# EAGLE design flags (EAGLE 9.2.2)
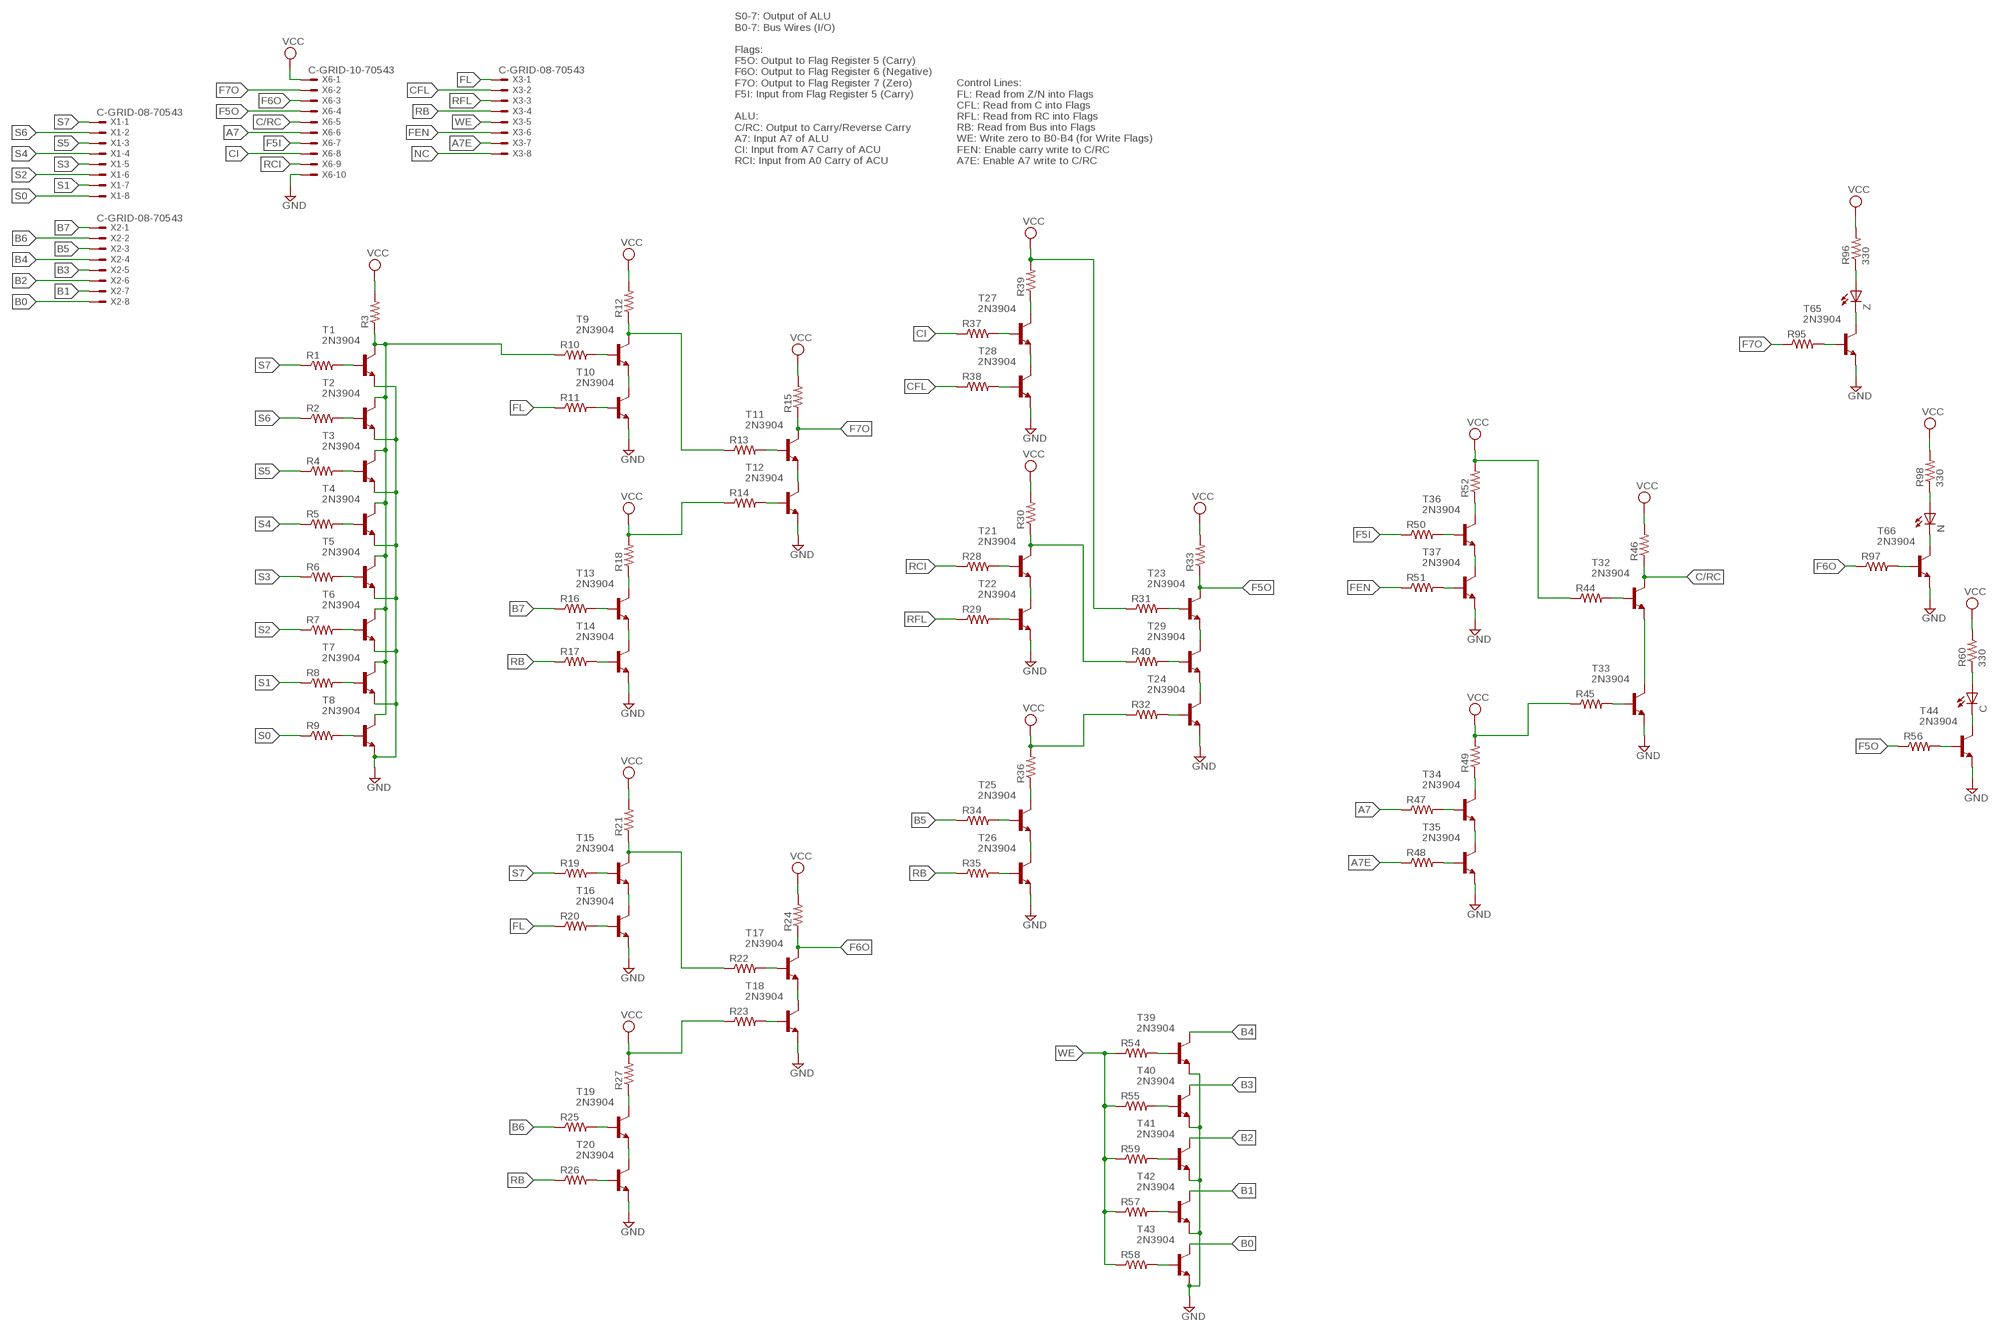
[diagram p0: schematic, sheet 1]

## Parts
C  LED5MM  [LED5MM]
N  LED5MM  [LED5MM]
R1  R-US_0309/10  [0309/10]
R2  R-US_0309/10  [0309/10]
R3  R-US_0309/10  [0309/10]
R4  R-US_0309/10  [0309/10]
R5  R-US_0309/10  [0309/10]
R6  R-US_0309/10  [0309/10]
R7  R-US_0309/10  [0309/10]
R8  R-US_0309/10  [0309/10]
R9  R-US_0309/10  [0309/10]
R10  R-US_0309/10  [0309/10]
R11  R-US_0309/10  [0309/10]
R12  R-US_0309/10  [0309/10]
R13  R-US_0309/10  [0309/10]
R14  R-US_0309/10  [0309/10]
R15  R-US_0309/10  [0309/10]
R16  R-US_0309/10  [0309/10]
R17  R-US_0309/10  [0309/10]
R18  R-US_0309/10  [0309/10]
R19  R-US_0309/10  [0309/10]
R20  R-US_0309/10  [0309/10]
R21  R-US_0309/10  [0309/10]
R22  R-US_0309/10  [0309/10]
R23  R-US_0309/10  [0309/10]
R24  R-US_0309/10  [0309/10]
R25  R-US_0309/10  [0309/10]
R26  R-US_0309/10  [0309/10]
R27  R-US_0309/10  [0309/10]
R28  R-US_0309/10  [0309/10]
R29  R-US_0309/10  [0309/10]
R30  R-US_0309/10  [0309/10]
R31  R-US_0309/10  [0309/10]
R32  R-US_0309/10  [0309/10]
R33  R-US_0309/10  [0309/10]
R34  R-US_0309/10  [0309/10]
R35  R-US_0309/10  [0309/10]
R36  R-US_0309/10  [0309/10]
R37  R-US_0309/10  [0309/10]
R38  R-US_0309/10  [0309/10]
R39  R-US_0309/10  [0309/10]
R40  R-US_0309/10  [0309/10]
R44  R-US_0309/10  [0309/10]
R45  R-US_0309/10  [0309/10]
R46  R-US_0309/10  [0309/10]
R47  R-US_0309/10  [0309/10]
R48  R-US_0309/10  [0309/10]
R49  R-US_0309/10  [0309/10]
R50  R-US_0309/10  [0309/10]
R51  R-US_0309/10  [0309/10]
R52  R-US_0309/10  [0309/10]
R54  R-US_0309/10  [0309/10]
R55  R-US_0309/10  [0309/10]
R56  R-US_0309/10  [0309/10]
R57  R-US_0309/10  [0309/10]
R58  R-US_0309/10  [0309/10]
R59  R-US_0309/10  [0309/10]
R60  330  R-US_0309/10  [0309/10]
R95  R-US_0309/10  [0309/10]
R96  330  R-US_0309/10  [0309/10]
R97  R-US_0309/10  [0309/10]
R98  330  R-US_0309/10  [0309/10]
T1  2N3904  [TO92]
T2  2N3904  [TO92]
T3  2N3904  [TO92]
T4  2N3904  [TO92]
T5  2N3904  [TO92]
T6  2N3904  [TO92]
T7  2N3904  [TO92]
T8  2N3904  [TO92]
T9  2N3904  [TO92]
T10  2N3904  [TO92]
T11  2N3904  [TO92]
T12  2N3904  [TO92]
T13  2N3904  [TO92]
T14  2N3904  [TO92]
T15  2N3904  [TO92]
T16  2N3904  [TO92]
T17  2N3904  [TO92]
T18  2N3904  [TO92]
T19  2N3904  [TO92]
T20  2N3904  [TO92]
T21  2N3904  [TO92]
T22  2N3904  [TO92]
T23  2N3904  [TO92]
T24  2N3904  [TO92]
T25  2N3904  [TO92]
T26  2N3904  [TO92]
T27  2N3904  [TO92]
T28  2N3904  [TO92]
T29  2N3904  [TO92]
T32  2N3904  [TO92]
T33  2N3904  [TO92]
T34  2N3904  [TO92]
T35  2N3904  [TO92]
T36  2N3904  [TO92]
T37  2N3904  [TO92]
T39  2N3904  [TO92]
T40  2N3904  [TO92]
T41  2N3904  [TO92]
T42  2N3904  [TO92]
T43  2N3904  [TO92]
T44  2N3904  [TO92]
T65  2N3904  [TO92]
T66  2N3904  [TO92]
X1  C-GRID-08-70543  [70543-08]
X2  C-GRID-08-70543  [70543-08]
X3  C-GRID-08-70543  [70543-08]
X6  C-GRID-10-70543  [70543-10]
Z  LED5MM  [LED5MM]

## Nets
A7: R47.1 X6.6
A7E: R48.1 X3.7
B0: T43.1(C) X2.8
B1: T42.1(C) X2.7
B2: T41.1(C) X2.6
B3: T40.1(C) X2.5
B4: T39.1(C) X2.4
B5: R34.1 X2.3
B6: R25.1 X2.2
B7: R16.1 X2.1
C/RC: R46.1 T32.1(C) X6.5
CFL: R38.1 X3.2
CI: R37.1 X6.8
F5I: R50.1 X6.7
F5O: R33.1 R56.1 T23.1(C) X6.4
F6O: R24.1 R97.1 T17.1(C) X6.3
F7O: R15.1 R95.1 T11.1(C) X6.2
FEN: R51.1 X3.6
FL: R11.1 R20.1 X3.1
GND: T1.3(E) T2.3(E) T3.3(E) T4.3(E) T5.3(E) T6.3(E) T7.3(E) T8.3(E) T10.3(E) T12.3(E) T14.3(E) T16.3(E) T18.3(E) T20.3(E) T22.3(E) T24.3(E) T26.3(E) T28.3(E) T33.3(E) T35.3(E) T37.3(E) T39.3(E) T40.3(E) T41.3(E) T42.3(E) T43.3(E) T44.3(E) T65.3(E) T66.3(E) X6.10
N$1: R3.1 R10.1 T1.1(C) T2.1(C) T3.1(C) T4.1(C) T5.1(C) T6.1(C) T7.1(C) T8.1(C)
N$2: R1.2 T1.2(B)
N$3: R2.2 T2.2(B)
N$4: R4.2 T3.2(B)
N$5: R5.2 T4.2(B)
N$6: R6.2 T5.2(B)
N$7: R7.2 T6.2(B)
N$8: R8.2 T7.2(B)
N$9: R9.2 T8.2(B)
N$10: R30.1 R40.1 T21.1(C)
N$11: R12.1 R13.1 T9.1(C)
N$12: T9.3(E) T10.1(C)
N$13: R11.2 T10.2(B)
N$14: R10.2 T9.2(B)
N$15: R21.1 R22.1 T15.1(C)
N$16: T15.3(E) T16.1(C)
N$17: R20.2 T16.2(B)
N$18: R19.2 T15.2(B)
N$19: R18.1 T13.1(C)
N$20: R16.2 T13.2(B)
N$21: R17.2 T14.2(B)
N$22: T13.3(E) T14.1(C)
N$23: R27.1 T19.1(C)
N$24: R14.2 T12.2(B)
N$25: T11.3(E) T12.1(C)
N$26: R13.2 T11.2(B)
N$27: R25.2 T19.2(B)
N$28: R26.2 T20.2(B)
N$29: T19.3(E) T20.1(C)
N$30: R23.2 T18.2(B)
N$31: T17.3(E) T18.1(C)
N$32: R22.2 T17.2(B)
N$33: T21.3(E) T22.1(C)
N$34: R29.2 T22.2(B)
N$35: R28.2 T21.2(B)
N$36: R36.1 T25.1(C)
N$37: R34.2 T25.2(B)
N$38: R35.2 T26.2(B)
N$39: T25.3(E) T26.1(C)
N$40: R32.2 T24.2(B)
N$41: T23.3(E) T29.1(C)
N$42: R31.2 T23.2(B)
N$43: R39.1 T27.1(C)
N$44: R37.2 T27.2(B)
N$45: R38.2 T28.2(B)
N$46: T27.3(E) T28.1(C)
N$47: T24.1(C) T29.3(E)
N$48: R40.2 T29.2(B)
N$53: R49.1 T34.1(C)
N$54: R47.2 T34.2(B)
N$55: R48.2 T35.2(B)
N$56: T34.3(E) T35.1(C)
N$57: R45.2 T33.2(B)
N$58: R44.2 T32.2(B)
N$59: R52.1 T36.1(C)
N$60: R50.2 T36.2(B)
N$61: R51.2 T37.2(B)
N$62: T36.3(E) T37.1(C)
N$63: T32.3(E) T33.1(C)
N$66: R56.2 T44.2(B)
N$67: R54.2 T39.2(B)
N$68: R55.2 T40.2(B)
N$69: R59.2 T41.2(B)
N$70: R57.2 T42.2(B)
N$71: R58.2 T43.2(B)
N$72: C.A R60.1
N$73: C.K(C) T44.1(C)
N$121: R96.1 Z.A
N$122: R95.2 T65.2(B)
N$123: R97.2 T66.2(B)
N$124: T65.1(C) Z.K(C)
N$125: N.A R98.1
N$126: N.K(C) T66.1(C)
NC: X3.8
RB: R17.1 R26.1 R35.1 X3.4
RCI: R28.1 X6.9
RFL: R29.1 X3.3
S0: R9.1 X1.8
S1: R8.1 X1.7
S2: R7.1 X1.6
S3: R6.1 X1.5
S4: R5.1 X1.4
S5: R4.1 X1.3
S6: R2.1 X1.2
S7: R1.1 R19.1 X1.1
VCC: R3.2 R12.2 R14.1 R15.2 R18.2 R21.2 R23.1 R24.2 R27.2 R30.2 R31.1 R32.1 R33.2 R36.2 R39.2 R44.1 R45.1 R46.2 R49.2 R52.2 R60.2 R96.2 R98.2 X6.1
WE: R54.1 R55.1 R57.1 R58.1 R59.1 X3.5

## Notes on the sheet
- S0-7: Output of ALU
  B0-7: Bus Wires (I/O)
  
  Flags:
  F5O: Output to Flag Register 5 (Carry)
  F6O: Output to Flag Register 6 (Negative)
  F7O: Output to Flag Register 7 (Zero)
  F5I: Input from Flag Register 5 (Carry)
  
  ALU:
  C/RC: Output to Carry/Reverse Carry
  A7: Input A7 of ALU
  CI: Input from A7 Carry of ACU
  RCI: Input from A0 Carry of ACU
- Control Lines:
  FL: Read from Z/N into Flags
  CFL: Read from C into Flags
  RFL: Read from RC into Flags
  RB: Read from Bus into Flags
  WE: Write zero to B0-B4 (for Write Flags)
  FEN: Enable carry write to C/RC
  A7E: Enable A7 write to C/RC

## Library data of the parts
C N Z = led:LED: LED OSRAM: - CHIPLED LG R971, LG N971, LY N971, LG Q971, LY Q971, LO R971, LY R971 LH N974, LH R974 LS Q976, LO Q976, LY Q976 LO Q996 - Hyper CHIPLED LW Q18S LB Q993, LB Q99A, LB R99A - SideLED LS A670, LO A670, LY A670, LG A670, LP A670 LB A673, LV A673, LT A673, LW A673 LH A674 LY A675 LS A676, LA A676, LO A676, LY A676, LW A676 LS A679, LY A679, LG A679 - Hyper Micro SIDELED® LS Y876, LA Y876, LO Y876, LY Y876 LT Y87S - SmartLED LW L88C, LW L88S LB L89C, LB L89S, LG L890 LS L89K, LO L89K, LY L89K LS L896, LA L896, LO L896, LY L896 - TOPLED LS T670, LO T670, LY T670, LG T670, LP T670 LSG T670, LSP T670, LSY T670, LOP T670, LYG T670 LG T671, LOG T671, LSG T671 LB T673, LV T673, LT T673, LW T673 LH T674 LS T676, LA T676, LO T676, LY T676, LB T676, LH T676, LSB T676, LW T676 LB T67C, LV T67C, LT T67C, LS T67K, LO T67K, LY T67K, LW E67C LS E67B, LA E67B, LO E67B, LY E67B, LB E67C, LV E67C, LT E67C LW T67C LS T679, LY T679, LG T679 LS T770, LO T770, LY T770, LG T770, LP T770 LB T773, LV T773, LT T773, LW T773 LH T774 LS E675, LA E675, LY E675, LS T675 LS T776, LA T776, LO T776, LY T776, LB T776 LHGB T686 LT T68C, LB T68C - Hyper Mini TOPLED® LB M676 - Mini TOPLED Santana® LG M470 LS M47K, LO M47K, LY M47K Source: http://www.osram.convergy.de LUXEON: - LUMILED® LXK2-PW12-R00, LXK2-PW12-S00, LXK2-PW14-U00, LXK2-PW14-V00 LXK2-PM12-R00, LXK2-PM12-S00, LXK2-PM14-U00 LXK2-PE12-Q00, LXK2-PE12-R00, LXK2-PE12-S00, LXK2-PE14-T00, LXK2-PE14-U00 LXK2-PB12-K00, LXK2-PB12-L00, LXK2-PB12-M00, LXK2-PB14-N00, LXK2-PB14-P00, LXK2-PB14-Q00 LXK2-PR12-L00, LXK2-PR12-M00, LXK2-PR14-Q00, LXK2-PR14-R00 LXK2-PD12-Q00, LXK2-PD12-R00, LXK2-PD12-S00 LXK2-PH12-R00, LXK2-PH12-S00 LXK2-PL12-P00, LXK2-PL12-Q00, LXK2-PL12-R00 Source: www.luxeon.com KINGBRIGHT: KA-3528ASYC Source: www.kingbright.com
R1-R40 R44-R52 R54-R60 R95-R98 = resistor:R-US_: RESISTOR, American symbol
T1-T29 T32-T37 T39-T44 T65 T66 = transistor:2N3904: NPN TRANSISTOR
X1-X3 = con-molex:C-GRID-08: CONNECTOR wire to board 2.54 mm (0.100") pitch header; MF: MOLEX; OC_FARNELL: unknown; OC_NEWARK: unknown
X6 = con-molex:C-GRID-10: CONNECTOR wire to board 2.54 mm (0.100") pitch header; MF: MOLEX; OC_FARNELL: unknown; OC_NEWARK: unknown

## Board
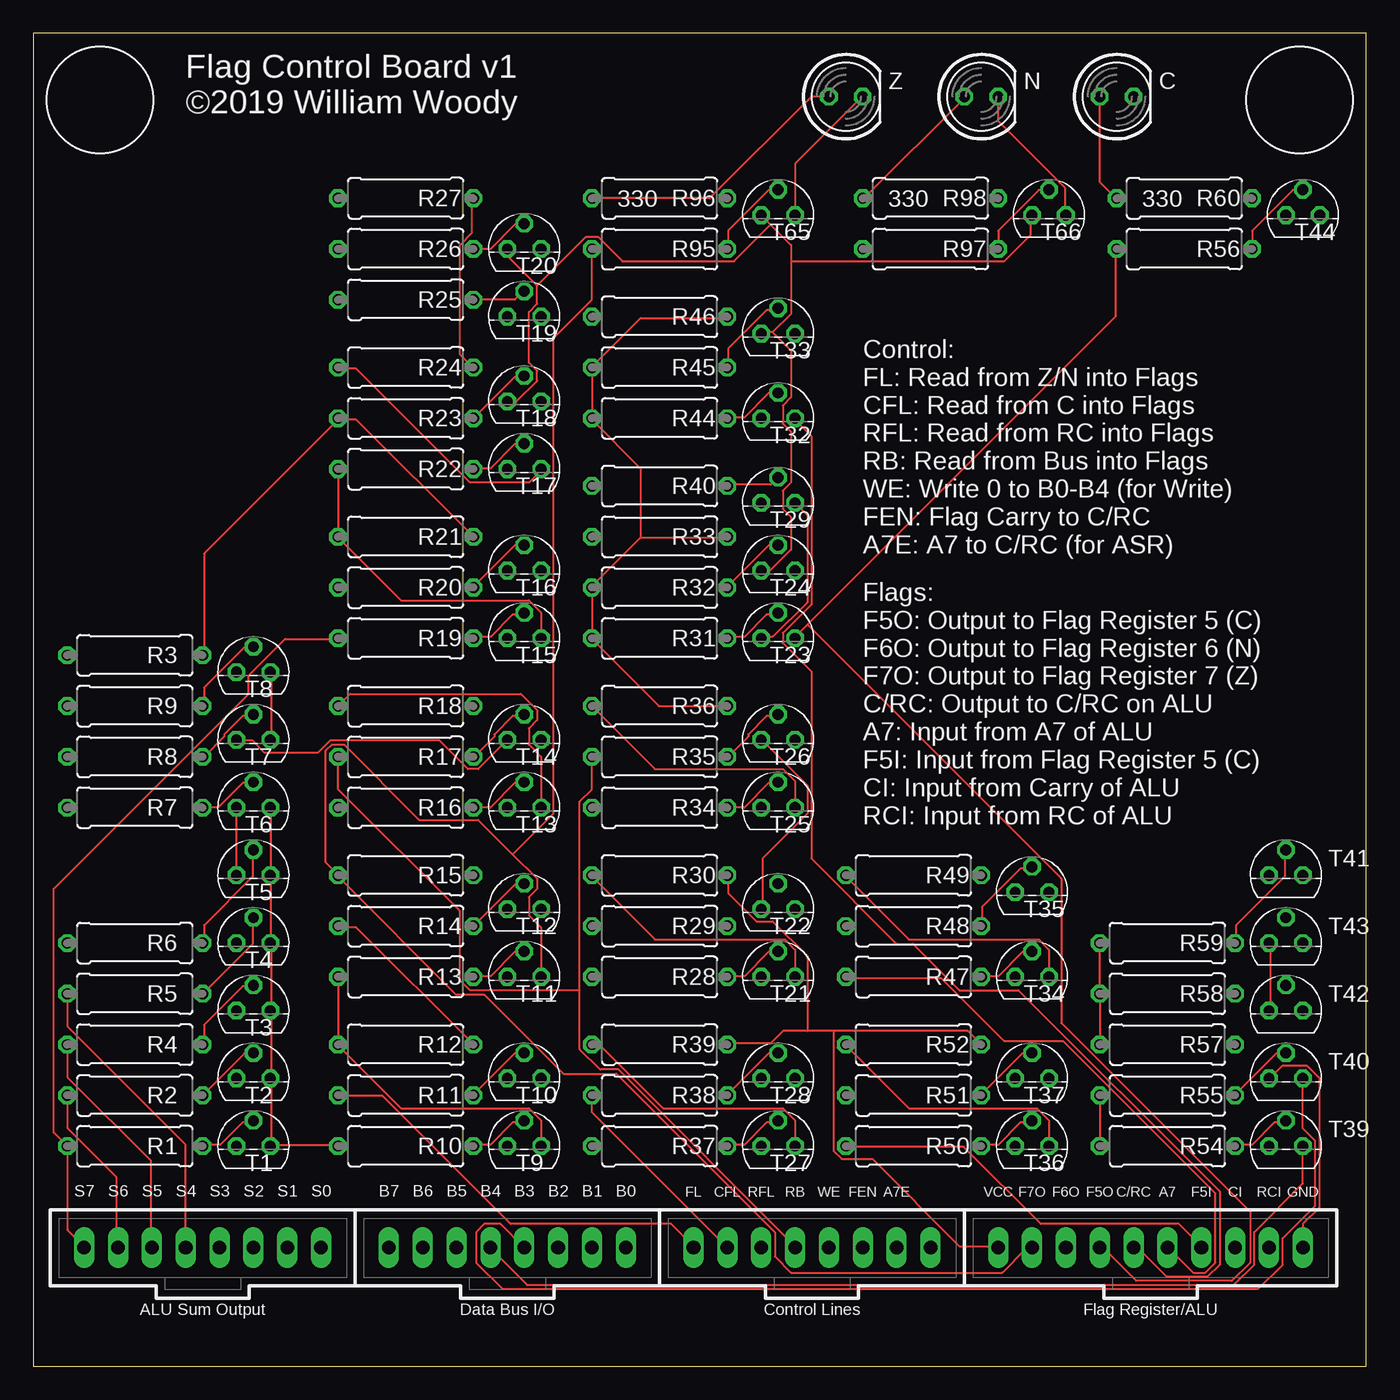
[diagram p1: board, top side]
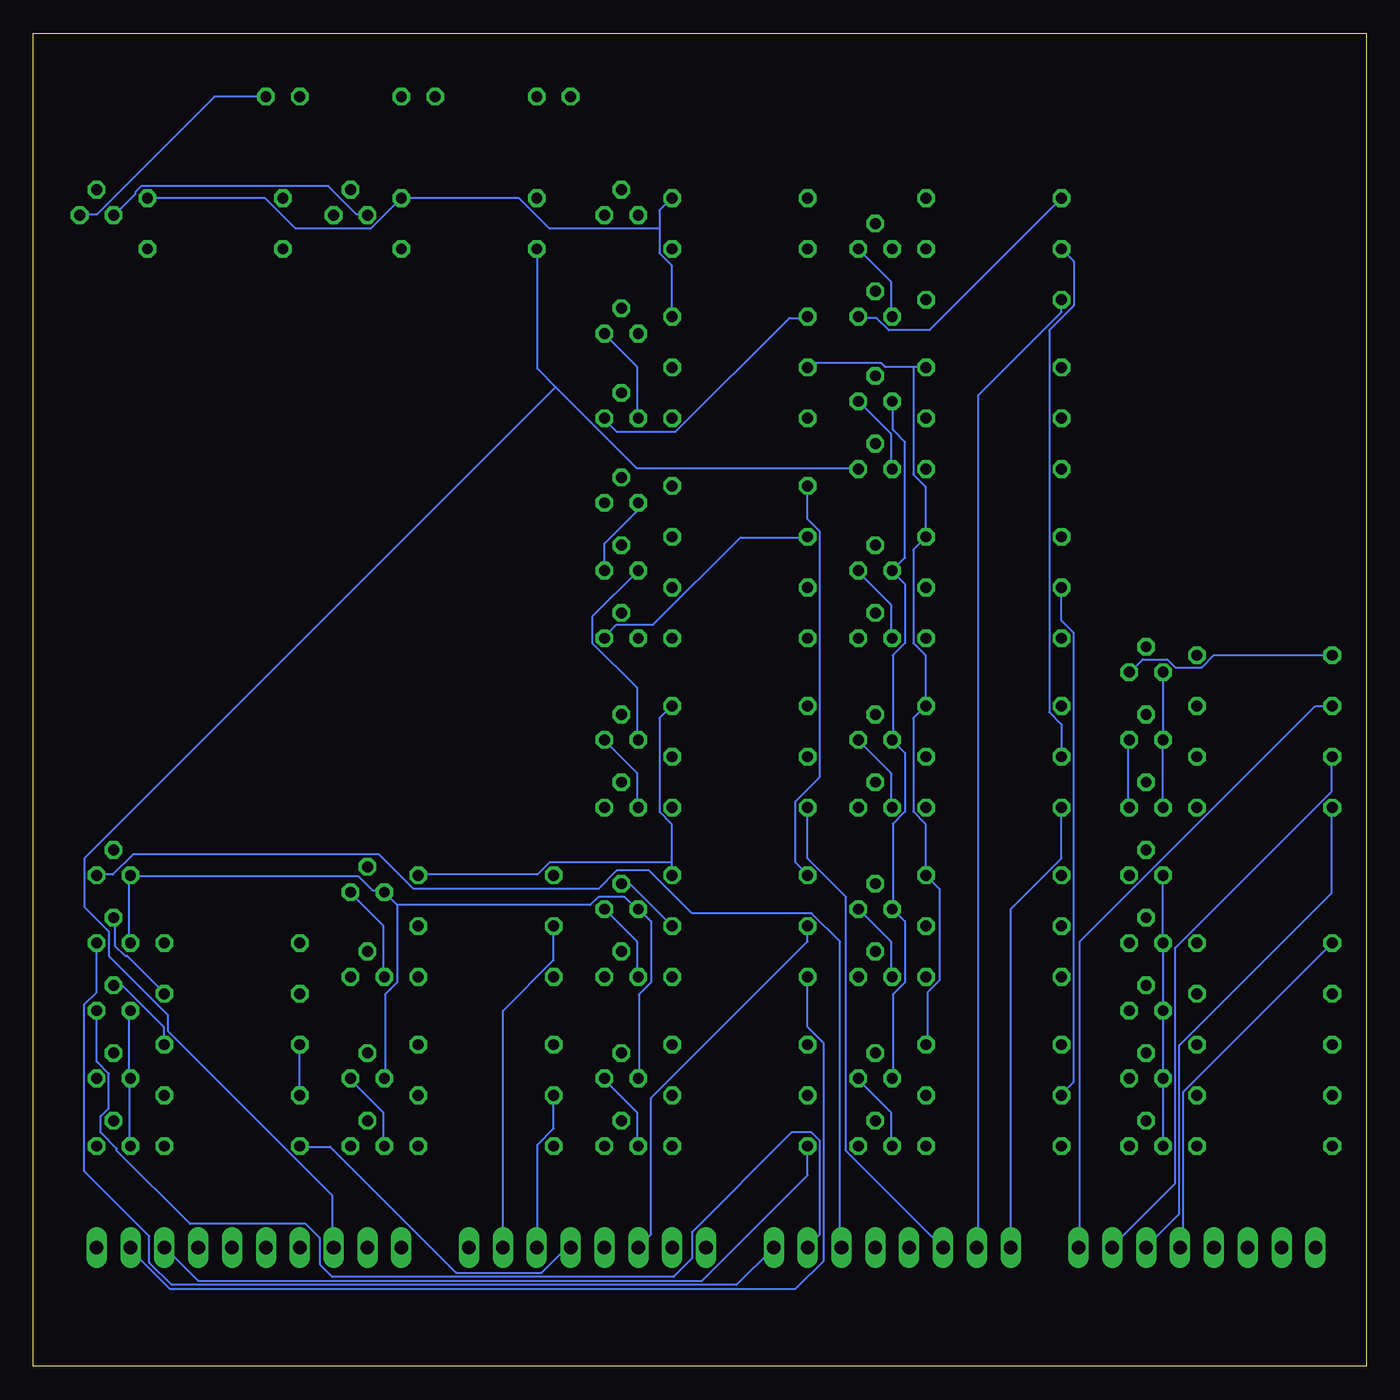
[diagram p2: board, bottom side, seen from below]

Size 100 x 100 mm. Coordinates in mm from the lower left corner, seen from the top.
Outline: 0,0 100,0 100,100 0,100 0,0
Copper layers (1*16): Top 0.035mm / dielectric 1.5mm / Bottom 0.035mm
Design rules "default": minimum track width 6mil, minimum drill 0.35mm, track to track 6mil, track to pad 6mil, pad to pad 6mil, via to via 6mil, smd to smd 6mil, copper to edge 40mil, drill to drill 6mil, minimum pad ring 10mil, minimum via ring 8mil, stop-mask expansion 4mil, vias tented up to drill 0mil, thermal gap 10mil

### Footprints (pad centres in the part's own frame; a part is rotated, then mirrored left to right if it is on the bottom)
LED5MM = drill 0.813 octagon: A -1.27,0; K 1.27,0
0309/10 = drill 0.813 octagon: 1 -5.08,0; 2 5.08,0
TO92 = drill 0.813 octagon: 1 1.27,0; 2 0,1.905; 3 -1.27,0
70543-08 = drill 1.016 long: 1 -8.89,0; 2 -6.35,0; 3 -3.81,0; 4 -1.27,0; 5 1.27,0; 6 3.81,0; 7 6.35,0; 8 8.89,0
70543-10 = drill 1.016 long: 1 -11.43,0; 2 -8.89,0; 3 -6.35,0; 4 -3.81,0; 5 -1.27,0; 6 1.27,0; 7 3.81,0; 8 6.35,0; 9 8.89,0; 10 11.43,0

### Placement (x,y rotation side)
C  81.28,95.25 0 top
N  71.12,95.25 0 top
R1  7.62,16.51 0 top
R2  7.62,20.32 0 top
R3  7.62,53.34 0 top
R4  7.62,24.13 0 top
R5  7.62,27.94 0 top
R6  7.62,31.75 0 top
R7  7.62,41.91 0 top
R8  7.62,45.72 0 top
R9  7.62,49.53 0 top
R10  27.94,16.51 0 top
R11  27.94,20.32 0 top
R12  27.94,24.13 0 top
R13  27.94,29.21 0 top
R14  27.94,33.02 0 top
R15  27.94,36.83 0 top
R16  27.94,41.91 0 top
R17  27.94,45.72 0 top
R18  27.94,49.53 0 top
R19  27.94,54.61 0 top
R20  27.94,58.42 0 top
R21  27.94,62.23 0 top
R22  27.94,67.31 0 top
R23  27.94,71.12 0 top
R24  27.94,74.93 0 top
R25  27.94,80.01 0 top
R26  27.94,83.82 0 top
R27  27.94,87.63 0 top
R28  46.99,29.21 0 top
R29  46.99,33.02 0 top
R30  46.99,36.83 0 top
R31  46.99,54.61 0 top
R32  46.99,58.42 0 top
R33  46.99,62.23 0 top
R34  46.99,41.91 0 top
R35  46.99,45.72 0 top
R36  46.99,49.53 0 top
R37  46.99,16.51 0 top
R38  46.99,20.32 0 top
R39  46.99,24.13 0 top
R40  46.99,66.04 0 top
R44  46.99,71.12 0 top
R45  46.99,74.93 0 top
R46  46.99,78.74 0 top
R47  66.04,29.21 0 top
R48  66.04,33.02 0 top
R49  66.04,36.83 0 top
R50  66.04,16.51 0 top
R51  66.04,20.32 0 top
R52  66.04,24.13 0 top
R54  85.09,16.51 0 top
R55  85.09,20.32 0 top
R56  86.36,83.82 0 top
R57  85.09,24.13 0 top
R58  85.09,27.94 0 top
R59  85.09,31.75 0 top
R60  86.36,87.63 0 top
R95  46.99,83.82 0 top
R96  46.99,87.63 0 top
R97  67.31,83.82 0 top
R98  67.31,87.63 0 top
T1  16.51,16.51 0 top
T2  16.51,21.59 0 top
T3  16.51,26.67 0 top
T4  16.51,31.75 0 top
T5  16.51,36.83 0 top
T6  16.51,41.91 0 top
T7  16.51,46.99 0 top
T8  16.51,52.07 0 top
T9  36.83,16.51 0 top
T10  36.83,21.59 0 top
T11  36.83,29.21 0 top
T12  36.83,34.29 0 top
T13  36.83,41.91 0 top
T14  36.83,46.99 0 top
T15  36.83,54.61 0 top
T16  36.83,59.69 0 top
T17  36.83,67.31 0 top
T18  36.83,72.39 0 top
T19  36.83,78.74 0 top
T20  36.83,83.82 0 top
T21  55.88,29.21 0 top
T22  55.88,34.29 0 top
T23  55.88,54.61 0 top
T24  55.88,59.69 0 top
T25  55.88,41.91 0 top
T26  55.88,46.99 0 top
T27  55.88,16.51 0 top
T28  55.88,21.59 0 top
T29  55.88,64.77 0 top
T32  55.88,71.12 0 top
T33  55.88,77.47 0 top
T34  74.93,29.21 0 top
T35  74.93,35.56 0 top
T36  74.93,16.51 0 top
T37  74.93,21.59 0 top
T39  93.98,16.51 0 top
T40  93.98,21.59 0 top
T41  93.98,36.83 0 top
T42  93.98,26.67 0 top
T43  93.98,31.75 0 top
T44  95.25,86.36 0 top
T65  55.88,86.36 0 top
T66  76.2,86.36 0 top
X1  12.7,8.89 0 top
X2  35.56,8.89 0 top
X3  58.42,8.89 0 top
X6  83.82,8.89 0 top
Z  60.96,95.25 0 top

### Tracks (layer width: path | path; a pad name or v marks a point on that pad's centre or on a via)
A7
  Top 0.152: R47.1 60.96,29.11 68.12,29.11 72.85,24.38 77.27,24.38 88.7,12.95 88.7,7.77 87.94,7.01 87.02,7.01 85.19,8.84 X6.6
A7E
  Bottom 0.152: R48.1 60.96,30.48 64.77,26.67 X3.7
B0
  Bottom 0.152: T43.1 95.25,28.04 96.16,27.13 96.16,14.63 91.29,9.75 91.29,7.77 89.61,6.1 47.24,6.1 X2.8
B1
  Bottom 0.152: T42.1 95.25,22.86 94.34,21.95 94.34,19.36 94.94,18.75 94.94,17.53 93.73,16.31 93.73,16.15 88.24,10.67 79.55,10.67 78.49,9.6 78.49,7.62 77.57,6.71 51.97,6.71 50.6,8.08 50.6,10.06 43.13,17.53 41.6,17.53 41,16.92 41,9.91 41.91,8.99 X2.7
B2
  Bottom 0.152: T41.1 95.25,36.88 94.03,36.88 92.51,38.41 74.07,38.41 71.48,35.81 57.61,35.81 56.24,37.19 53.8,37.19 50.6,33.98 41.6,33.98 39.47,31.85 39.47,8.99 X2.6
B3
  Top 0.152: T40.1 95.25,17.83 96.16,16.92 96.16,12.04 93.73,9.6 93.73,7.62 91.9,5.79 35.2,5.79 33.22,7.77 33.22,10.06 33.83,10.67 35.05,10.67 X2.5
B4
  Top 0.152: T39.1 95.25,13.72 91.59,10.06 91.59,7.62 90.07,6.1 37.03,6.1 34.29,8.84 X2.4
B5
  Bottom 0.152: R34.1 41.91,38.1 39.01,35.2 39.01,16.15 X2.3
B6
  Bottom 0.152: R25.1 22.86,79.1 29.11,72.85 29.11,8.99 X2.2
B7
  Bottom 0.152: R16.1 22.86,38.1 26.67,34.29 X2.1
C/RC
  Top 0.152: X6.5 82.6,8.84 82.91,8.84 85.04,6.71 88.09,6.71 89,7.62 89,13.11 73.91,28.19 69.49,28.19 65.99,31.7 64.77,31.7 58.37,38.1 58.37,52.12 56.24,54.25 56.24,55.02 58.37,57.15 58.37,69.8 57.15,71.02 T32.1
  Bottom 0.152: R46.1 41.91,78.64 43.28,78.64 51.82,70.1 56.24,70.1 57.15,71.02 T32.1
CFL
  Top 0.152: R38.1 41.91,19.05 X3.2
CI
  Bottom 0.152: R37.1 41.91,14.33 49.84,6.4 87.63,6.4 90.07,8.84 X6.8
F5I
  Top 0.152: R50.1 60.96,16.46 69.8,16.46 75.59,10.67 85.95,10.67 87.63,8.99 X6.7
F5O
  Top 0.152: 58.06,55.63 57.15,54.71 T23.1 | 58.06,55.63 81.23,78.79 81.23,83.82 R56.1 | 58.06,55.63 77.11,36.58 77.11,25.76 91.29,11.58 91.29,7.77 89.92,6.4 82.75,6.4 80.31,8.84 80.01,8.84 X6.4
  Bottom 0.152: R33.1 41.91,62.18 46.94,62.18 53.49,55.63 56.24,55.63 57.15,54.71 T23.1
F6O
  Top 0.152: R24.1 22.86,74.83 24.23,74.83 32.77,66.29 37.19,66.29 38.1,67.21 T17.1
  Bottom 0.152: 60.81,73.46 54.71,67.36 38.1,67.36 T17.1 | 60.81,73.46 62.18,74.83 62.18,83.82 R97.1 | 60.81,73.46 96.16,38.1 96.16,34.44 94.34,32.61 94.34,30.79 89.92,26.36 89.92,25.15 77.57,12.8 77.57,8.99 X6.3
F7O
  Top 0.152: T11.1 38.1,32.92 37.19,33.83 37.19,35.2 37.8,35.81 37.8,36.58 35.97,38.41 | 35.97,38.41 33.38,41 28.96,41 23.32,46.63 22.4,46.63 21.95,46.18 21.95,37.8 22.86,36.88 R15.1 22.86,36.73 31.7,27.89 33.83,27.89 39.78,21.95 43.74,21.95 55.63,10.06 55.63,8.23 56.84,7.01 72.69,7.01 74.52,8.84 74.83,8.84 X6.2 | R95.1 41.91,80.01 39.01,77.11 39.01,41.45 35.97,38.41
FEN
  Bottom 0.152: R51.1 60.96,17.83 62.18,16.61 62.18,8.99 X3.6
FL
  Top 0.152: R11.1 22.86,20.27 26.21,20.27 35.81,10.67 47.85,10.67 49.53,8.99 X3.1
  Bottom 0.152: R20.1 22.86,55.93 21.95,55.02 21.95,21.34 22.86,20.42 R11.1
GND
  Top 0.152: T42.3 92.81,26.67 92.81,31.7 T43.3 | X6.10 95.25,10.67 96.47,11.89 96.47,21.64 95.56,22.55 93.73,22.55 92.81,21.64 T40.3 | T22.3 54.71,34.29 54.71,38.1 58.06,41.45 58.06,43.59 54.71,46.94 T26.3 | 55.47,77.57 54.71,77.57 T33.3 | 55.47,77.57 56.84,78.94 56.84,82.91 | 56.84,82.91 56.84,84.12 55.32,85.65 | T65.3 55.32,85.65 | 56.84,82.91 72.85,82.91 74.83,84.89 74.83,86.26 T66.3 | T5.3 T6.3 | 37.8,81.08 35.66,83.21 35.66,83.82 T20.3 | 37.8,81.08 37.8,79.7 37.19,79.1 37.19,75.29 37.8,74.68 37.8,73.91 36.27,72.39 T18.3 | T14.3 33.38,44.81 32.61,44.81 30.48,46.94 22.25,46.94 21.34,46.02 17.37,46.02 16.46,46.94 15.24,46.94 T7.3 | 55.32,85.65 52.58,82.91 44.2,82.91 42.37,84.73 41.45,84.73 37.8,81.08 | 55.47,77.57 56.84,76.2 56.84,72.69 56.24,72.08 56.24,70.71 56.84,70.1 56.84,66.29 56.24,65.68 56.24,64.31 56.84,63.7 56.84,61.27 55.32,59.74 54.71,59.74 T24.3
  Bottom 0.152: T43.3 92.81,31.85 92.81,36.73 T41.3 92.66,36.73 75.59,36.73 74.52,35.66 73.76,35.66 T35.3 72.69,34.59 | T39.3 92.81,16.61 92.81,21.49 T40.3 92.81,21.64 92.81,26.67 T42.3 | 72.69,34.59 72.69,28.8 73.61,27.89 73.61,21.64 T37.3 | T28.3 54.56,21.64 54.56,27.89 53.65,28.8 53.65,33.38 54.56,34.29 T22.3 54.71,34.29 55.63,35.2 57.61,35.2 58.22,34.59 72.69,34.59 | T24.3 58.06,56.24 58.06,54.25 54.71,50.9 54.71,47.09 T26.3 | T44.3 93.88,86.41 92.35,87.94 92.35,88.09 91.9,88.54 77.88,88.54 75.74,86.41 74.98,86.41 T66.3 | T8.3 T7.3 T6.3 | T1.3 T2.3 T3.3 T4.3 T5.3 | 35.51,34.29 34.59,33.38 34.59,28.8 35.51,27.89 35.51,21.64 T10.3 | T18.3 35.51,72.39 35.51,70.26 34.59,69.34 34.59,60.66 T16.3 35.51,59.59 34.59,58.67 34.59,54.25 35.51,53.34 35.51,47.09 T14.3 34.59,46.02 34.59,41.6 35.51,40.69 35.51,34.29 | 35.51,34.29 T12.3
N$1
  Top 0.152: T7.1 17.83,47.09 17.83,51.97 T8.1 | 17.83,16.61 17.83,21.49 T2.1 17.83,21.64 17.83,26.67 | 17.83,16.61 22.86,16.61 R10.1 | 17.83,16.61 T1.1 | 17.83,26.67 17.83,31.7 T4.1 17.83,31.85 17.83,36.73 T5.1 17.83,36.88 17.83,41.91 T6.1 | 17.83,26.67 T3.1
  Bottom 0.152: R3.1 11.43,53.34 12.34,52.43 14.33,52.43 14.94,53.03 16.76,53.03 17.68,52.12 T8.1 | T7.1 17.83,46.94 17.83,41.91 T6.1
N$2
  Top 0.152: R1.2 12.8,16.61 14.02,16.61 15.7,18.29 16.46,18.29 T1.2
N$3
  Top 0.152: R2.2 15.85,23.47 16.46,23.47 T2.2
N$4
  Top 0.152: R4.2 12.8,24.23 12.8,25.6 15.7,28.5 16.46,28.5 T3.2
N$5
  Top 0.152: R5.2 16.46,31.7 16.46,33.53 T4.2
N$6
  Top 0.152: R6.2 12.8,31.85 12.8,33.07 16.46,36.73 16.46,38.71 T5.2
N$7
  Top 0.152: R7.2 13.87,41.91 15.7,43.74 16.46,43.74 T6.2
N$8
  Top 0.152: R8.2 12.8,45.72 14.33,47.24 14.33,47.4 15.7,48.77 16.46,48.77 T7.2
N$9
  Top 0.152: R9.2 12.8,49.53 12.8,50.9 15.85,53.95 16.46,53.95 T8.2
N$10
  Top 0.152: T21.1 57.15,31.24 56.39,32 46.63,32 41.91,36.73 R30.1
  Bottom 0.152: R40.1 41.91,63.55 41,62.64 41,44.2 42.82,42.37 42.82,37.8 41.91,36.88 R30.1
N$11
  Top 0.152: R13.1 R12.1 22.86,24.08 27.58,19.36 37.19,19.36 38.1,18.44 T9.1
N$12
  Bottom 0.152: T9.3 35.66,16.61 35.66,19.05 38.1,21.49 T10.1
N$13
  Top 0.152: R11.2 33.07,20.42 36.12,23.47 36.73,23.47 T10.2
N$14
  Top 0.152: R10.2 33.07,16.61 34.29,16.61 35.97,18.29 36.73,18.29 T9.2
N$15
  Top 0.152: R22.1 R21.1 22.86,62.18 27.58,57.45 37.19,57.45 38.1,56.54 T15.1
N$16
  Bottom 0.152: T15.3 35.66,54.71 35.66,57.15 38.1,59.59 T16.1
N$17
  Top 0.152: R20.2 33.07,58.52 36.12,61.57 36.73,61.57 T16.2
N$18
  Top 0.152: R19.2 33.07,54.71 34.29,54.71 35.97,56.39 36.73,56.39 T15.2
N$19
  Top 0.152: T13.1 38.1,45.72 37.19,46.63 37.19,47.85 37.8,48.46 37.8,49.23 36.58,50.44 23.77,50.44 R18.1
N$20
  Top 0.152: R16.2 34.29,41.91 36.12,43.74 36.73,43.74 T13.2
N$21
  Top 0.152: R17.2 33.07,45.72 34.59,47.24 34.59,47.4 35.97,48.77 36.73,48.77 T14.2
N$22
  Bottom 0.152: T13.3 35.66,41.91 35.66,44.5 38.1,46.94 T14.1
N$23
  Bottom 0.152: R27.1 32.77,77.72 35.81,77.72 36.73,78.64 38.1,78.64 T19.1
N$24
  Top 0.152: R14.2 36.12,36.12 36.73,36.12 T12.2
N$25
  Bottom 0.152: T12.1 35.66,31.85 35.66,29.26 T11.3
N$26
  Top 0.152: R13.2 33.07,29.26 34.29,29.26 36.12,31.09 36.73,31.09 T11.2
N$27
  Top 0.152: R25.2 36.12,80.01 36.73,80.62 T19.2
N$28
  Top 0.152: R26.2 34.29,83.82 36.12,85.65 36.73,85.65 T20.2
N$29
  Bottom 0.152: T20.1 35.66,81.38 35.66,78.79 T19.3
N$30
  Top 0.152: R23.2 36.12,74.22 36.73,74.22 T18.2
N$31
  Bottom 0.152: T18.1 35.66,69.95 35.66,67.36 T17.3
N$32
  Top 0.152: R22.2 33.07,67.36 34.29,67.36 36.12,69.19 36.73,69.19 T17.2
N$33
  Bottom 0.152: T22.1 54.71,31.85 54.71,29.26 T21.3
N$34
  Bottom 0.152: R29.2 55.17,36.12 55.78,36.12 T22.2
N$35
  Top 0.152: R28.2 52.12,29.26 53.34,29.26 55.17,31.09 55.78,31.09 T21.2
N$36
  Top 0.152: T25.1 57.15,43.89 56.24,44.81 46.63,44.81 R36.1
N$37
  Top 0.152: R34.2 53.34,41.91 55.17,43.74 55.78,43.74 T25.2
N$38
  Top 0.152: R35.2 52.12,45.72 53.65,47.24 53.65,47.4 55.02,48.77 55.78,48.77 T26.2
N$39
  Bottom 0.152: T25.3 54.71,41.91 54.71,44.5 57.15,46.94 T26.1
N$40
  Top 0.152: R32.2 52.12,58.52 55.17,61.57 55.78,61.57 T24.2
N$41
  Top 0.152: T29.1 58.06,63.86 58.06,57.3 55.47,54.71 54.71,54.71 T23.3
N$42
  Top 0.152: R31.2 52.12,54.71 53.34,54.71 55.02,56.39 55.78,56.39 T23.2
N$43
  Top 0.152: T27.1 57.15,18.44 56.24,19.36 47.24,19.36 42.52,24.08 41.91,24.08 R39.1
N$44
  Top 0.152: R37.2 52.12,16.61 53.34,16.61 55.02,18.29 55.78,18.29 T27.2
N$45
  Top 0.152: R38.2 52.12,20.42 55.17,23.47 55.78,23.47 T28.2
N$46
  Bottom 0.152: T27.3 54.71,16.61 54.71,19.05 57.15,21.49 T28.1
N$47
  Bottom 0.152: T24.1 57.15,61.72 54.71,64.16 54.71,64.77 T29.3
N$48
  Top 0.152: R40.2 52.12,66.14 55.32,66.14 55.78,66.6 T29.2
N$53
  Top 0.152: T34.1 76.2,31.24 75.44,32 65.68,32 60.96,36.73 R49.1
N$54
  Top 0.152: R47.2 71.17,29.26 72.39,29.26 74.22,31.09 74.83,31.09 T34.2
N$55
  Top 0.152: R48.2 71.17,33.07 71.17,34.44 74.07,37.34 74.83,37.34 T35.2
N$56
  Bottom 0.152: T34.3 73.76,29.26 73.76,33.07 76.2,35.51 T35.1
N$57
  Top 0.152: R45.2 52.12,74.98 52.12,76.35 55.02,79.25 55.78,79.25 T33.2
N$58
  Top 0.152: R44.2 52.12,71.17 53.34,71.17 55.17,73 55.78,73 T32.2
N$59
  Top 0.152: T36.1 76.2,18.44 75.29,19.36 65.68,19.36 60.96,24.08 R52.1
N$60
  Top 0.152: R50.2 71.17,16.61 72.39,16.61 74.07,18.29 74.83,18.29 T36.2
N$61
  Top 0.152: R51.2 71.17,20.42 74.22,23.47 74.83,23.47 T37.2
N$62
  Bottom 0.152: T36.3 73.76,16.61 73.76,19.05 76.2,21.49 T37.1
N$63
  Bottom 0.152: T32.3 54.71,71.17 54.71,74.98 57.15,77.42 T33.1
N$66
  Top 0.152: R56.2 91.44,85.19 94.49,88.24 95.25,88.24 T44.2
N$67
  Top 0.152: R54.2 90.22,16.61 91.44,16.61 93.12,18.29 93.88,18.29 T39.2
N$68
  Top 0.152: R55.2 90.22,20.42 93.27,23.47 93.88,23.47 T40.2
N$69
  Top 0.152: R59.2 90.22,31.85 90.22,33.07 93.88,36.73 93.88,38.71 T41.2
N$70
  Bottom 0.152: R57.2 90.22,24.23 90.22,25.45 93.27,28.5 93.88,28.5 T42.2
N$71
  Bottom 0.152: R58.2 90.22,28.04 92.96,30.79 93.12,30.79 93.88,31.55 93.88,33.53 T43.2
N$72
  Top 0.152: C.A 80.01,88.85 81.23,87.63 R60.1
N$73
  Bottom 0.152: C.K 86.41,95.25 95.25,86.41 96.47,86.41 T44.1
N$121
  Top 0.152: R96.1 50.75,87.63 58.37,95.25 Z.A
N$122
  Top 0.152: R95.2 52.12,83.82 52.12,85.19 55.17,88.24 55.78,88.24 T65.2
N$123
  Top 0.152: R97.2 72.39,85.19 75.44,88.24 76.2,88.24 T66.2
N$124
  Top 0.152: T65.1 57.15,90.22 62.18,95.25 Z.K
N$125
  Top 0.152: R98.1 62.33,87.63 69.95,95.25 N.A
N$126
  Top 0.152: N.K 72.39,93.42 77.42,88.39 77.42,86.41 T66.1
RB
  Top 0.152: R35.1 41.91,43.28 41,42.37 41,28.19 | 41,28.19 41,23.77 42.52,22.25 43.89,22.25 57.15,8.99 X3.4 | R17.1 22.86,43.28 32,34.14 32,28.96 32.77,28.19 41,28.19
  Bottom 0.152: R17.1 22.86,48.16 23.77,49.07 23.77,77.72 21.95,79.55 21.95,82.91 R26.1
RCI
  Bottom 0.152: R28.1 41.91,25.45 40.69,24.23 40.69,7.92 42.82,5.79 89.76,5.79 92.81,8.84 X6.9
RFL
  Bottom 0.152: R29.1 41.91,31.85 53.65,20.12 53.65,9.91 54.56,8.99 X3.3
S0
  Bottom 0.152: R9.1 3.81,49.53 21.49,31.85 21.49,8.99 X1.8
S1
  Bottom 0.152: R8.1 2.59,45.72 2.59,43.13 14.33,31.39 14.33,13.72 19.05,8.99 X1.7
S2
  Bottom 0.152: R7.1 2.59,41.91 2.59,35.51 14.02,24.08 14.02,11.43 16.46,8.99 X1.6
S3
  Bottom 0.152: R6.1 13.72,20.57 13.72,9.14 X1.5
S4
  Top 0.152: X1.4 11.43,16.61 2.59,25.45 2.59,27.89 R5.1
S5
  Top 0.152: R4.1 2.59,24.08 2.59,21.64 8.84,15.39 8.84,8.99 X1.3
S6
  Top 0.152: R2.1 2.59,20.27 2.59,17.83 6.25,14.17 6.25,8.99 X1.2
S7
  Top 0.152: X1.1 3.81,8.99 2.59,10.21 2.59,16.46 R1.1 1.52,17.53 1.52,35.81 16.15,50.44 16.15,51.82 18.9,54.56 22.86,54.56 R19.1
VCC
  Top 0.152: 60.05,25.15 70.1,25.15 R52.2 | 60.05,25.15 58.06,25.15 | 58.06,25.15 56.24,25.15 55.32,24.23 52.12,24.23 R39.2 | 60.05,25.15 60.05,16.15 60.66,15.54 62.94,15.54 69.49,8.99 72.39,8.99 X6.1 | 22.86,71.02 12.8,60.96 12.8,53.34 R3.2 | R12.2 24.23,32.92 22.86,32.92 R14.1 | 45.57,62.18 51.97,62.18 R33.2 | 45.57,62.18 41.91,58.52 R32.1 R31.1 41.91,54.56 46.94,49.53 R36.2 | R27.2 32.92,87.63 32.92,85.04 32,84.12 32,75.89 32.92,74.98 R24.2 | 45.57,62.18 45.57,67.36 41.91,71.02 R44.1 R45.1 41.91,74.98 45.57,78.64 51.97,78.64 R46.2 | 22.86,71.02 24.23,71.02 R21.2 | 22.86,71.02 R23.1 | 58.06,25.15 58.06,30.79 55.47,33.38 54.25,33.38 52.12,35.51 52.12,36.73 R30.2
  Bottom 0.152: 53.03,85.34 53.03,86.72 52.12,87.63 R96.2 | 53.03,85.34 53.03,83.52 52.12,82.6 52.12,78.79 R46.2 | 53.03,85.34 61.27,85.34 63.55,87.63 R98.2 74.68,85.34 80.31,85.34 82.6,87.63 R60.2 | 52.12,37.8 52.12,40.69 53.03,41.6 53.03,48.62 52.12,49.53 R36.2 | 52.12,37.8 52.12,36.88 R30.2 | 52.12,37.8 61.27,37.8 62.18,36.88 71.02,36.88 R49.2 | R12.2 32.92,24.23 32.92,28.04 32,28.96 32,35.81 R15.2 33.07,36.88 33.07,40.69 33.98,41.6 33.98,48.62 33.07,49.53 | 33.07,49.53 33.07,53.34 33.98,54.25 33.98,61.27 R21.2 33.07,62.33 33.07,65.99 33.98,66.9 33.98,74.98 | 33.98,74.98 36.12,74.98 36.42,75.29 41.6,75.29 41.91,74.98 R45.1 | 33.98,74.98 33.07,74.98 R24.2 | 33.07,49.53 R18.2
WE
  Top 0.152: R57.1 R58.1 R59.1 | R55.1 R54.1
  Bottom 0.152: X3.5 59.74,8.84 60.05,8.84 61.87,7.01 68.28,7.01 77.72,16.46 80.01,16.46 R54.1 | R55.1 R57.1

### Text on the board
tPlace: Flag Control Board v1 / ©2019 William Woody | Control: / FL: Read from Z/N into Flags / CFL: Read from C into Flags / RFL: Read from RC into Flags / RB: Read from Bus into Flags / WE: Write 0 to B0-B4 (for Write) / FEN: Flag Carry to C/RC / A7E: A7 to C/RC (for ASR) | Flags: / F5O: Output to Flag Register 5 (C) / F6O: Output to Flag Register 6 (N) / F7O: Output to Flag Register 7 (Z) / C/RC: Output to C/RC on ALU / A7: Input from A7 of ALU / F5I: Input from Flag Register 5 (C) / CI: Input from Carry of ALU / RCI: Input from RC of ALU | S7 | S6 | S5 | S4 | S3 | S2 | S1 | S0 | B7 | B6 | B5 | B4 | B3 | B2 | B1 | B0 | FL | CFL | RFL | RB | WE | FEN | A7E | VCC | F7O | F6O | F5O | C/RC | A7 | F5I | CI | RCI | GND | ALU Sum Output | Data Bus I/O | Control Lines | Flag Register/ALU